# Altium schematic sheet STM_System_Board.schdoc
size 420 x 297 mm; EDA_Number: ARTIQ; Author: G.Kasprowicz; CompanyName: WUT ISE; DrawnBy: G.Kasprowicz, P. Kulik; DocumentNumber: 1; SheetNumber: 1; ModifiedBy: -; CheckedDate: -; Title2: Top; Designer: G.Kasprowicz, P. Kulik; ModifiedDate: -; ProjectName: Sensor Box
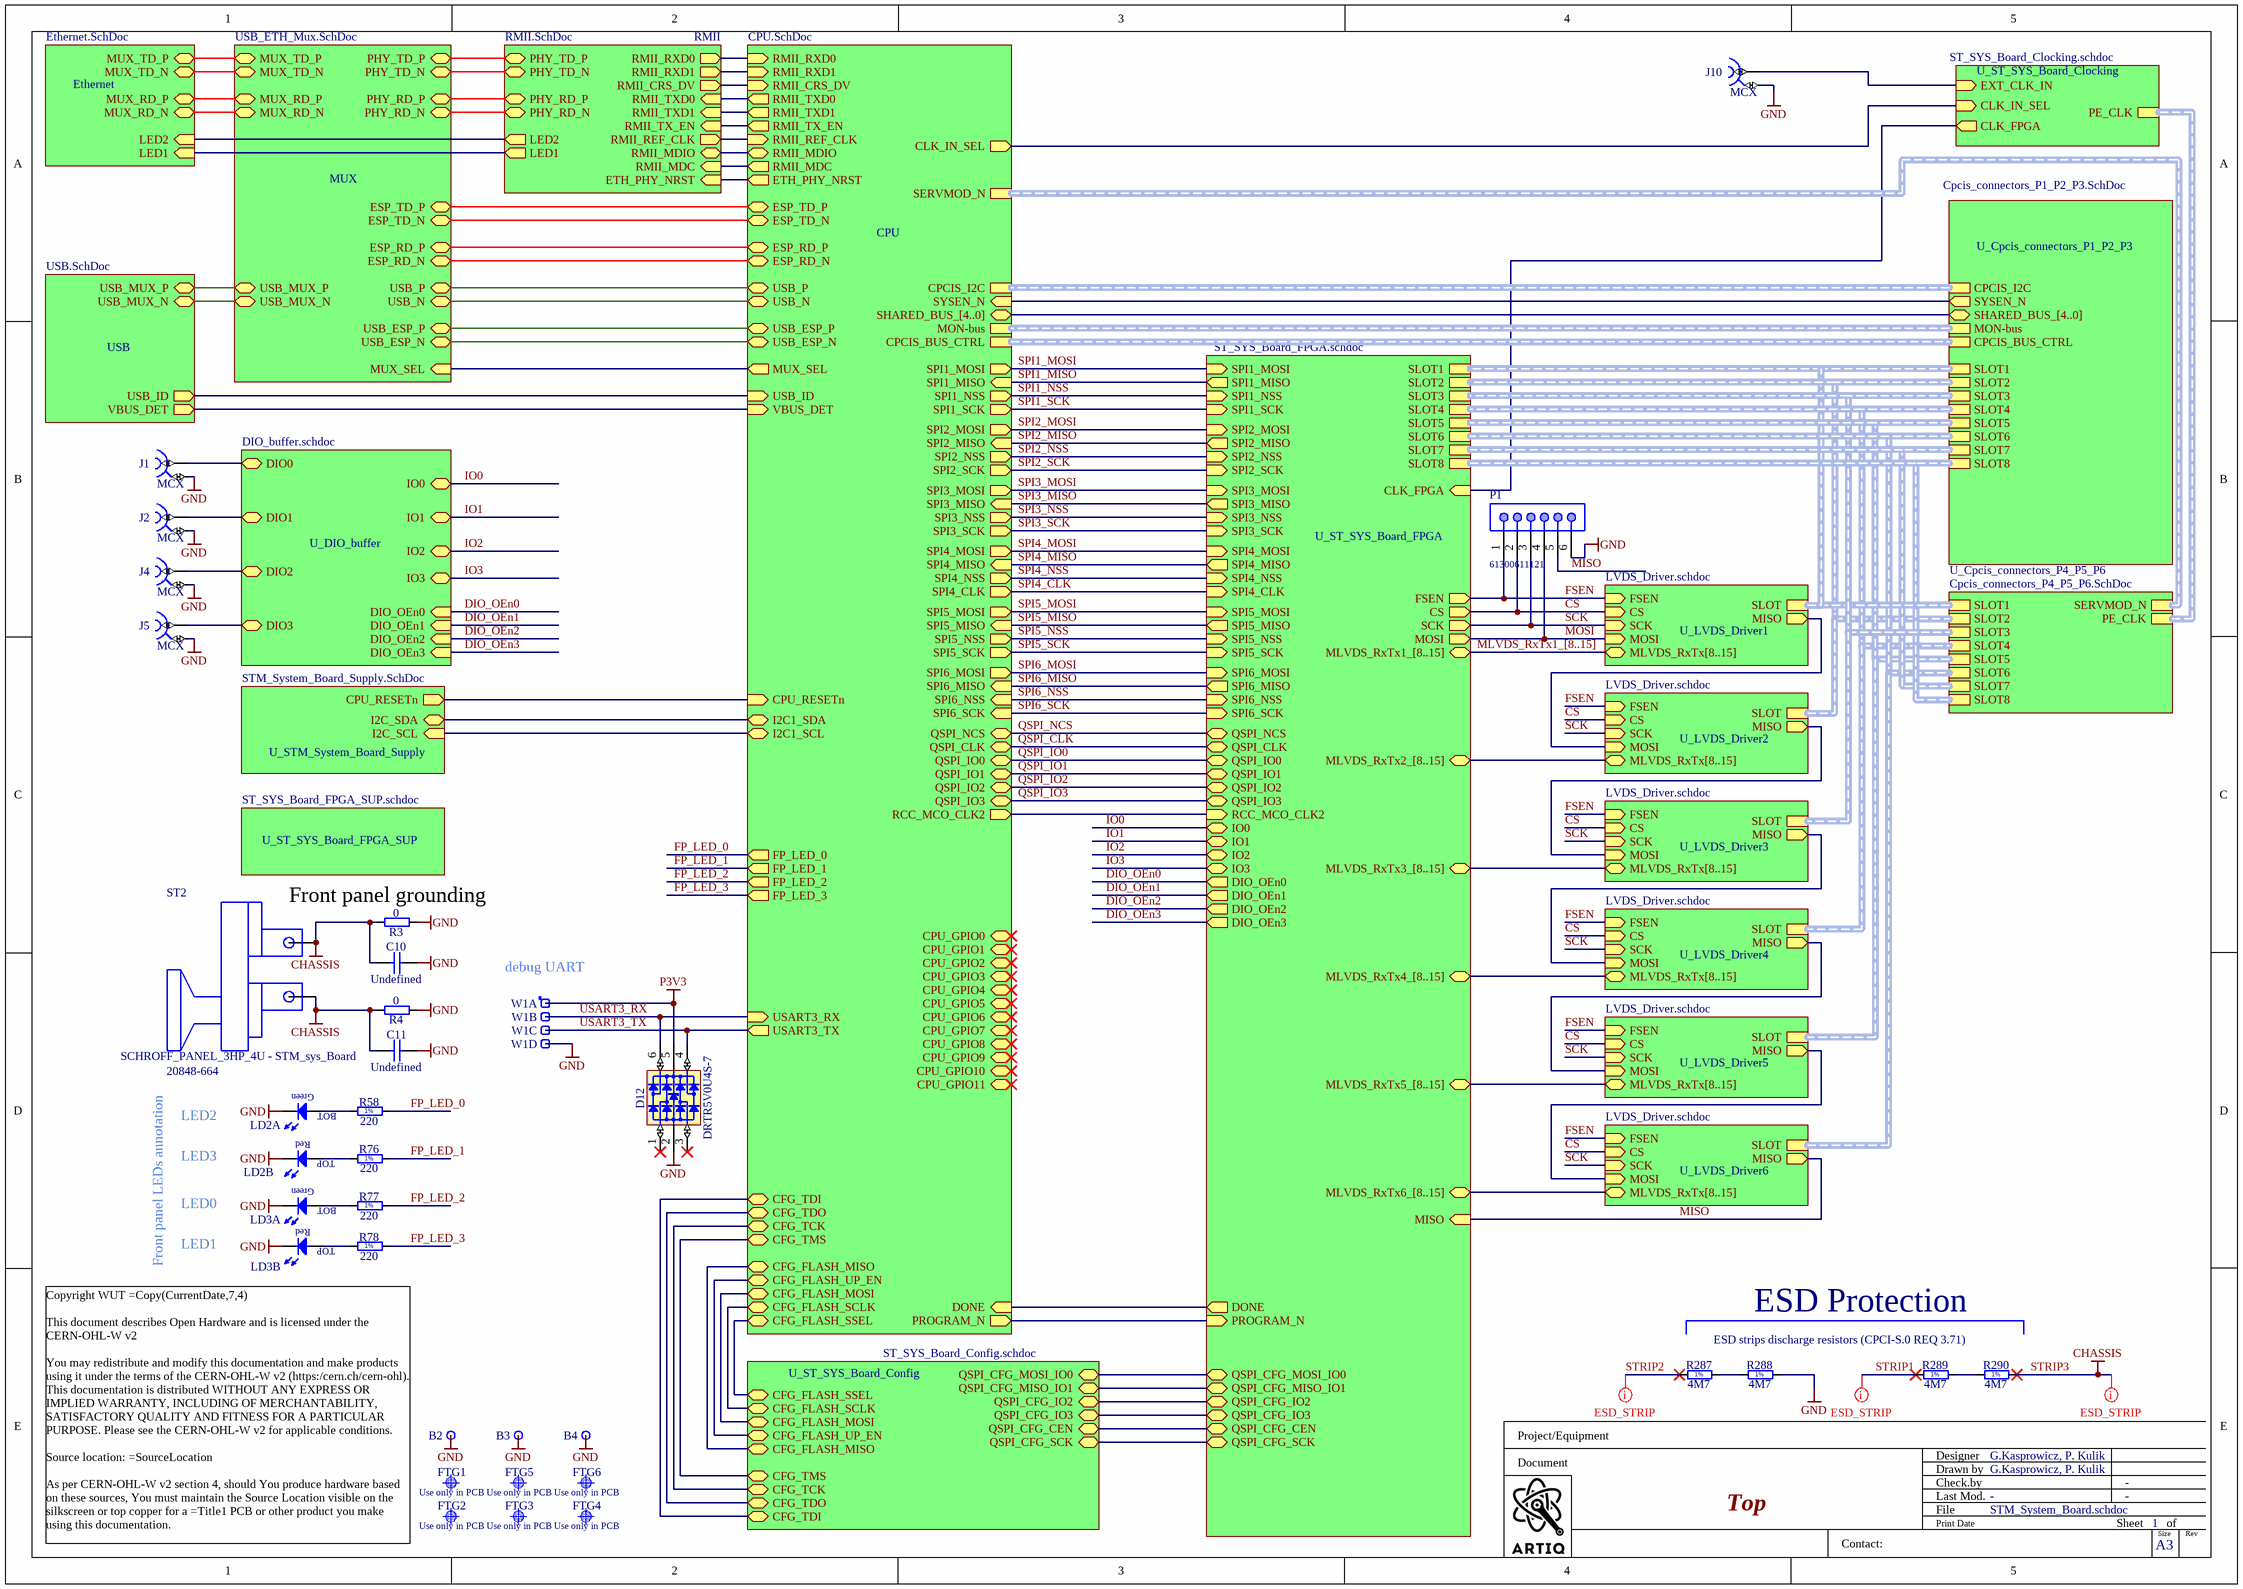
[diagram p0: STM_System_Board.schdoc]

## Parts
B2  Plated Hole  [c170h100]  (value not drawn)  (no BOM)
B3  Plated Hole  [c170h100]  (value not drawn)  (no BOM)
B4  Plated Hole  [c170h100]  (value not drawn)  (no BOM)
C10  Undefined  [CAPC2012X135N]
C11  Undefined  [CAPC2012X135N]
D12  DRTR5V0U4S-7  [SOT65P210X110-6N]
FTG1  Use only in PCB  [FIDUCIAL_TOP_C100-200]
FTG2  Use only in PCB  [FIDUCIAL_TOP_S100-200]
FTG3  Use only in PCB  [FIDUCIAL_TOP_S100-200]
FTG4  Use only in PCB  [FIDUCIAL_TOP_S100-200]
FTG5  Use only in PCB  [FIDUCIAL_TOP_C100-200]
FTG6  Use only in PCB  [FIDUCIAL_TOP_C100-200]
J1  MCX  [AMPHENOL_919-383J-51A]
J2  MCX  [AMPHENOL_919-383J-51A]
J4  MCX  [AMPHENOL_919-383J-51A]
J5  MCX  [AMPHENOL_919-383J-51A]
J10  MCX  [AMPHENOL_919-383J-51A]
LD2  Red/Green  [LED_DIALIGHT_571-0112F]  (value not drawn)  (parts A,B of 2)
LD3  Red/Green  [LED_DIALIGHT_571-0112F]  (value not drawn)  (parts A,B of 2)
P1  61300611121  [61300611121]
R3  0  [RESC1608X55N]
R4  0  [RESC1608X55N]
R58  220  [RESC1608X55N]
R76  220  [RESC1608X55N]
R77  220  [RESC1608X55N]
R78  220  [RESC1608X55N]
R287  4M7  [RESC2113X55N]
R288  4M7  [RESC2113X55N]
R289  4M7  [RESC2113X55N]
R290  4M7  [RESC2113X55N]
ST2  SCHROFF_PANEL_3HP_4U - STM_sys_Board  Manufacturer Part Number 2: 20848-664  [SCHROFF_PANEL_3HP_4U - STM_sys_Board]
W1  Header 4  [SAMTEC_HTSW-104-23-L-S]  (value not drawn)  (parts A,B,C,D of 4)

## Sub-sheets
CPU = CPU.SchDoc: SPI4_MOSI (out), SPI4_NSS (out), SPI4_CLK (out), SPI4_MISO (in), SPI1_SCK (out), SPI1_NSS (out), SPI1_MISO (in), SPI1_MOSI (out), SPI2_MOSI (out), SPI2_NSS (out), SPI2_SCK (out), SPI2_MISO (in), SPI3_SCK (out), SPI3_MOSI (out), SPI3_MISO (in), SPI3_NSS (out), SPI6_MOSI (out), SPI6_MISO (in), SPI6_NSS (in), SPI6_SCK (in), SPI5_NSS (out), SPI5_SCK (out), SPI5_MOSI (out), QSPI_IO0 (bidir), QSPI_NCS (bidir), QSPI_IO3 (bidir), QSPI_CLK (bidir), QSPI_IO1 (bidir), QSPI_IO2 (bidir), SERVMOD_N (harness SERVMOD_N), MON-bus (harness MON-bus), CPCIS_BUS_CTRL (harness CPCIS_BUS_CTRL), RMII_TXD0 (out), RMII_TX_EN (out), RMII_RXD0 (in), RMII_REF_CLK (in), RMII_CRS_DV (in), RMII_MDC (out), RMII_MDIO (bidir), RMII_TXD1 (out), RMII_RXD1 (in), ETH_PHY_NRST (out), SHARED_BUS_[4..0] (bidir), SYSEN_N (in), CPCIS_I2C (harness I2C), PROGRAM_N (out), CPU_GPIO3 (bidir), CPU_GPIO8 (bidir), CPU_GPIO4 (bidir), CPU_GPIO9 (bidir), CPU_GPIO5 (bidir), CPU_GPIO1 (bidir), CPU_GPIO7 (bidir), CPU_GPIO6 (bidir), CPU_GPIO2 (bidir), CPU_GPIO10 (bidir), CPU_GPIO11 (bidir), CPU_GPIO0 (bidir), DONE (in), RCC_MCO_CLK2 (out), SPI5_MISO (in), CPU_RESETn (in), I2C1_SDA (bidir), I2C1_SCL (bidir), CLK_IN_SEL (out), CFG_FLASH_SSEL (bidir), CFG_FLASH_SCLK (bidir), CFG_FLASH_MOSI (bidir), CFG_FLASH_UP_EN (bidir), CFG_FLASH_MISO (bidir), USART3_TX (out), USART3_RX (in), CFG_TMS (bidir), CFG_TCK (bidir), CFG_TDO (bidir), CFG_TDI (bidir), FP_LED_0 (out), FP_LED_1 (out), FP_LED_2 (out), FP_LED_3 (out), ESP_RD_P (bidir), ESP_TD_P (bidir), ESP_RD_N (bidir), ESP_TD_N (bidir), USB_N (bidir), USB_P (bidir), USB_ID (in), VBUS_DET (in), USB_ESP_N (bidir), USB_ESP_P (bidir), MUX_SEL (out)
Ethernet = Ethernet.SchDoc: MUX_RD_P (bidir), MUX_TD_P (bidir), MUX_RD_N (bidir), MUX_TD_N (bidir), LED2 (in), LED1 (in)
MUX = USB_ETH_Mux.SchDoc: MUX_RD_P (bidir), MUX_TD_P (bidir), MUX_RD_N (bidir), MUX_TD_N (bidir), PHY_RD_P (bidir), PHY_TD_P (bidir), PHY_RD_N (bidir), PHY_TD_N (bidir), ESP_RD_P (bidir), ESP_TD_P (bidir), ESP_RD_N (bidir), ESP_TD_N (bidir), USB_MUX_N (bidir), USB_MUX_P (bidir), USB_N (bidir), USB_P (bidir), USB_ESP_N (bidir), USB_ESP_P (bidir), MUX_SEL (in)
RMII = RMII.SchDoc: RMII_TXD0 (in), RMII_TX_EN (in), RMII_RXD0 (out), RMII_REF_CLK (out), RMII_CRS_DV (out), RMII_MDC (in), RMII_MDIO (bidir), ETH_PHY_NRST (in), RMII_TXD1 (in), RMII_RXD1 (out), PHY_RD_P (bidir), PHY_TD_P (bidir), PHY_RD_N (bidir), PHY_TD_N (bidir), LED2 (out), LED1 (out)
U_Cpcis_connectors_P1_P2_P3 = Cpcis_connectors_P1_P2_P3.SchDoc: CPCIS_BUS_CTRL (harness CPCIS_BUS_CTRL), MON-bus (harness MON-bus), SYSEN_N (out), SLOT7 (harness SLOT), SLOT2 (harness SLOT), SLOT3 (harness SLOT), SLOT1 (harness SLOT), SLOT4 (harness SLOT), SLOT5 (harness SLOT), SLOT6 (harness SLOT), SLOT8 (harness SLOT), SHARED_BUS_[4..0] (bidir), CPCIS_I2C (harness I2C)
U_Cpcis_connectors_P4_P5_P6 = Cpcis_connectors_P4_P5_P6.SchDoc: PE_CLK (harness PE_CLK), SLOT7 (harness SLOT), SLOT2 (harness SLOT), SLOT3 (harness SLOT), SLOT1 (harness SLOT), SLOT4 (harness SLOT), SLOT5 (harness SLOT), SLOT6 (harness SLOT), SLOT8 (harness SLOT), SERVMOD_N (harness SERVMOD_N)
U_DIO_buffer = DIO_buffer.schdoc: DIO_OEn0 (in), DIO_OEn1 (in), DIO_OEn2 (in), DIO_OEn3 (in), IO0 (bidir), IO1 (bidir), IO2 (bidir), IO3 (bidir), DIO0 (bidir), DIO1 (bidir), DIO2 (bidir), DIO3 (bidir)
U_LVDS_Driver1 = LVDS_Driver.schdoc: FSEN (in), CS (in), SCK (in), MOSI (in), MISO (out), SLOT (harness SLOT), MLVDS_RxTx[8..15] (bidir)
U_LVDS_Driver2 = LVDS_Driver.schdoc: FSEN (in), CS (in), SCK (in), MOSI (in), MISO (out), SLOT (harness SLOT), MLVDS_RxTx[8..15] (bidir)
U_LVDS_Driver3 = LVDS_Driver.schdoc: FSEN (in), CS (in), SCK (in), MOSI (in), MISO (out), SLOT (harness SLOT), MLVDS_RxTx[8..15] (bidir)
U_LVDS_Driver4 = LVDS_Driver.schdoc: FSEN (in), CS (in), SCK (in), MOSI (in), MISO (out), SLOT (harness SLOT), MLVDS_RxTx[8..15] (bidir)
U_LVDS_Driver5 = LVDS_Driver.schdoc: FSEN (in), CS (in), SCK (in), MOSI (in), MISO (out), SLOT (harness SLOT), MLVDS_RxTx[8..15] (bidir)
U_LVDS_Driver6 = LVDS_Driver.schdoc: FSEN (in), CS (in), SCK (in), MOSI (in), MISO (out), SLOT (harness SLOT), MLVDS_RxTx[8..15] (bidir)
U_ST_SYS_Board_Clocking = ST_SYS_Board_Clocking.schdoc: CLK_FPGA (out), PE_CLK (harness PE_CLK), CLK_IN_SEL (in), EXT_CLK_IN (in)
U_ST_SYS_Board_Config = ST_SYS_Board_Config.schdoc: QSPI_CFG_MOSI_IO0 (bidir), QSPI_CFG_MISO_IO1 (bidir), QSPI_CFG_IO2 (bidir), QSPI_CFG_IO3 (bidir), QSPI_CFG_CEN (bidir), QSPI_CFG_SCK (bidir), CFG_FLASH_SSEL (bidir), CFG_FLASH_SCLK (bidir), CFG_FLASH_MOSI (bidir), CFG_FLASH_UP_EN (bidir), CFG_FLASH_MISO (bidir), CFG_TMS (bidir), CFG_TCK (bidir), CFG_TDO (bidir), CFG_TDI (bidir)
U_ST_SYS_Board_FPGA = ST_SYS_Board_FPGA.schdoc: QSPI_NCS (bidir), QSPI_CLK (bidir), QSPI_IO0 (bidir), QSPI_IO1 (bidir), QSPI_IO2 (bidir), QSPI_IO3 (bidir), SPI1_MOSI (in), SPI1_MISO (out), SPI1_NSS (in), SPI1_SCK (in), SPI2_MOSI (in), SPI2_MISO (out), SPI2_NSS (in), SPI2_SCK (in), SPI3_MOSI (in), SPI3_MISO (out), SPI3_NSS (in), SPI3_SCK (in), SPI4_MOSI (in), SPI4_MISO (out), SPI4_NSS (in), SPI4_CLK (in), SPI5_MOSI (in), SPI5_NSS (in), SPI5_SCK (in), SPI6_MOSI (in), SPI6_MISO (out), SPI6_NSS (in), SPI6_SCK (in), SLOT7 (harness SLOT), SLOT2 (harness SLOT), SLOT3 (harness SLOT), SLOT1 (harness SLOT), SLOT4 (harness SLOT), SLOT5 (harness SLOT), SLOT6 (harness SLOT), SLOT8 (harness SLOT), FSEN (out), CS (out), SCK (out), MLVDS_RxTx1_[8..15] (bidir), MLVDS_RxTx2_[8..15] (bidir), MLVDS_RxTx4_[8..15] (bidir), MLVDS_RxTx3_[8..15] (bidir), MLVDS_RxTx6_[8..15] (bidir), MLVDS_RxTx5_[8..15] (bidir), MOSI (out), MISO (in), IO0 (bidir), IO1 (bidir), IO2 (bidir), IO3 (bidir), DIO_OEn0 (out), DIO_OEn1 (out), DIO_OEn2 (out), DIO_OEn3 (out), PROGRAM_N (in), DONE (out), CLK_FPGA (in), SPI5_MISO (out), RCC_MCO_CLK2 (in), QSPI_CFG_IO2 (bidir), QSPI_CFG_IO3 (bidir), QSPI_CFG_MISO_IO1 (bidir), QSPI_CFG_CEN (bidir), QSPI_CFG_MOSI_IO0 (bidir), QSPI_CFG_SCK (bidir)
U_ST_SYS_Board_FPGA_SUP = ST_SYS_Board_FPGA_SUP.schdoc: no entries
U_STM_System_Board_Supply = STM_System_Board_Supply.SchDoc: CPU_RESETn (out), I2C_SDA (bidir), I2C_SCL (in)
USB = USB.SchDoc: VBUS_DET (out), USB_MUX_N (bidir), USB_MUX_P (bidir), USB_ID (out)

## Nets
GND: B2.1 B3.1 B4.1 C10.2 C11.2 D12.2(GND) J1.2 J2.2 J4.2 J5.2 J10.2 LD2.1(C) LD2.3(C) LD3.1(C) LD3.3(C) P1.6 R3.1 R4.1 R288.2 W1.4
P3V3: D12.5(VBUS) W1.1
STRIP3: C10.1 C11.1 R3.2 R4.2 R290.2 ST2.0 ST2.1  [also labelled CHASSIS]
CS: P1.2 ; sheet U_ST_SYS_Board_FPGA/CS, sheet U_LVDS_Driver2/CS, sheet U_LVDS_Driver1/CS, sheet U_LVDS_Driver4/CS, sheet U_LVDS_Driver6/CS, sheet U_LVDS_Driver5/CS, sheet U_LVDS_Driver3/CS
DIO_OEn0: sheet U_ST_SYS_Board_FPGA/DIO_OEn0, sheet U_DIO_buffer/DIO_OEn0
DIO_OEn1: sheet U_ST_SYS_Board_FPGA/DIO_OEn1, sheet U_DIO_buffer/DIO_OEn1
DIO_OEn2: sheet U_ST_SYS_Board_FPGA/DIO_OEn2, sheet U_DIO_buffer/DIO_OEn2
DIO_OEn3: sheet U_ST_SYS_Board_FPGA/DIO_OEn3, sheet U_DIO_buffer/DIO_OEn3
FP_LED_0: R58.2 ; sheet CPU/FP_LED_0
FP_LED_1: R76.2 ; sheet CPU/FP_LED_1
FP_LED_2: R77.2 ; sheet CPU/FP_LED_2
FP_LED_3: R78.2 ; sheet CPU/FP_LED_3
FSEN: P1.1 ; sheet U_ST_SYS_Board_FPGA/FSEN, sheet U_LVDS_Driver2/FSEN, sheet U_LVDS_Driver1/FSEN, sheet U_LVDS_Driver4/FSEN, sheet U_LVDS_Driver6/FSEN, sheet U_LVDS_Driver5/FSEN, sheet U_LVDS_Driver3/FSEN
IO0: sheet U_ST_SYS_Board_FPGA/IO0, sheet U_DIO_buffer/IO0
IO1: sheet U_ST_SYS_Board_FPGA/IO1, sheet U_DIO_buffer/IO1
IO2: sheet U_ST_SYS_Board_FPGA/IO2, sheet U_DIO_buffer/IO2
IO3: sheet U_ST_SYS_Board_FPGA/IO3, sheet U_DIO_buffer/IO3
MISO: P1.5 ; sheet U_ST_SYS_Board_FPGA/MISO, sheet U_LVDS_Driver6/MISO
MOSI: P1.4 ; sheet U_ST_SYS_Board_FPGA/MOSI, sheet U_LVDS_Driver1/MOSI
QSPI_CLK: sheet CPU/QSPI_CLK, sheet U_ST_SYS_Board_FPGA/QSPI_CLK
QSPI_IO0: sheet CPU/QSPI_IO0, sheet U_ST_SYS_Board_FPGA/QSPI_IO0
QSPI_IO1: sheet CPU/QSPI_IO1, sheet U_ST_SYS_Board_FPGA/QSPI_IO1
QSPI_IO2: sheet CPU/QSPI_IO2, sheet U_ST_SYS_Board_FPGA/QSPI_IO2
QSPI_IO3: sheet CPU/QSPI_IO3, sheet U_ST_SYS_Board_FPGA/QSPI_IO3
QSPI_NCS: sheet CPU/QSPI_NCS, sheet U_ST_SYS_Board_FPGA/QSPI_NCS
SCK: P1.3 ; sheet U_ST_SYS_Board_FPGA/SCK, sheet U_LVDS_Driver2/SCK, sheet U_LVDS_Driver1/SCK, sheet U_LVDS_Driver4/SCK, sheet U_LVDS_Driver6/SCK, sheet U_LVDS_Driver5/SCK, sheet U_LVDS_Driver3/SCK
SPI1_MISO: sheet CPU/SPI1_MISO, sheet U_ST_SYS_Board_FPGA/SPI1_MISO
SPI1_MOSI: sheet CPU/SPI1_MOSI, sheet U_ST_SYS_Board_FPGA/SPI1_MOSI
SPI1_NSS: sheet CPU/SPI1_NSS, sheet U_ST_SYS_Board_FPGA/SPI1_NSS
SPI1_SCK: sheet CPU/SPI1_SCK, sheet U_ST_SYS_Board_FPGA/SPI1_SCK
SPI2_MISO: sheet CPU/SPI2_MISO, sheet U_ST_SYS_Board_FPGA/SPI2_MISO
SPI2_MOSI: sheet CPU/SPI2_MOSI, sheet U_ST_SYS_Board_FPGA/SPI2_MOSI
SPI2_NSS: sheet CPU/SPI2_NSS, sheet U_ST_SYS_Board_FPGA/SPI2_NSS
SPI2_SCK: sheet CPU/SPI2_SCK, sheet U_ST_SYS_Board_FPGA/SPI2_SCK
SPI3_MISO: sheet CPU/SPI3_MISO, sheet U_ST_SYS_Board_FPGA/SPI3_MISO
SPI3_MOSI: sheet CPU/SPI3_MOSI, sheet U_ST_SYS_Board_FPGA/SPI3_MOSI
SPI3_NSS: sheet CPU/SPI3_NSS, sheet U_ST_SYS_Board_FPGA/SPI3_NSS
SPI3_SCK: sheet CPU/SPI3_SCK, sheet U_ST_SYS_Board_FPGA/SPI3_SCK
SPI4_CLK: sheet CPU/SPI4_CLK, sheet U_ST_SYS_Board_FPGA/SPI4_CLK
SPI4_MISO: sheet CPU/SPI4_MISO, sheet U_ST_SYS_Board_FPGA/SPI4_MISO
SPI4_MOSI: sheet CPU/SPI4_MOSI, sheet U_ST_SYS_Board_FPGA/SPI4_MOSI
SPI4_NSS: sheet CPU/SPI4_NSS, sheet U_ST_SYS_Board_FPGA/SPI4_NSS
SPI5_MISO: sheet CPU/SPI5_MISO, sheet U_ST_SYS_Board_FPGA/SPI5_MISO
SPI5_MOSI: sheet CPU/SPI5_MOSI, sheet U_ST_SYS_Board_FPGA/SPI5_MOSI
SPI5_NSS: sheet CPU/SPI5_NSS, sheet U_ST_SYS_Board_FPGA/SPI5_NSS
SPI5_SCK: sheet CPU/SPI5_SCK, sheet U_ST_SYS_Board_FPGA/SPI5_SCK
SPI6_MISO: sheet CPU/SPI6_MISO, sheet U_ST_SYS_Board_FPGA/SPI6_MISO
SPI6_MOSI: sheet CPU/SPI6_MOSI, sheet U_ST_SYS_Board_FPGA/SPI6_MOSI
SPI6_NSS: sheet CPU/SPI6_NSS, sheet U_ST_SYS_Board_FPGA/SPI6_NSS
SPI6_SCK: sheet CPU/SPI6_SCK, sheet U_ST_SYS_Board_FPGA/SPI6_SCK
STRIP1: R289.1
STRIP2: R287.1
USART3_RX: D12.6(I/O4) W1.2 ; sheet CPU/USART3_RX
USART3_TX: D12.4(I/O3) W1.3 ; sheet CPU/USART3_TX
NetJ1_1: J1.1 ; sheet U_DIO_buffer/DIO0
NetJ2_1: J2.1 ; sheet U_DIO_buffer/DIO1
NetJ4_1: J4.1 ; sheet U_DIO_buffer/DIO2
NetJ5_1: J5.1 ; sheet U_DIO_buffer/DIO3
NetJ10_1: J10.1 ; sheet U_ST_SYS_Board_Clocking/EXT_CLK_IN
NetLD2_2: LD2.2(A) R58.1
NetLD2_4: LD2.4(A) R76.1
NetLD3_2: LD3.2(A) R77.1
NetLD3_4: LD3.4(A) R78.1
NetR287_2: R287.2 R288.1
NetR289_2: R289.2 R290.1
(unnamed): sheet USB/VBUS_DET, sheet CPU/VBUS_DET
(unnamed): sheet USB/USB_MUX_N, sheet MUX/USB_MUX_N
(unnamed): sheet USB/USB_MUX_P, sheet MUX/USB_MUX_P
(unnamed): sheet USB/USB_ID, sheet CPU/USB_ID
(unnamed): sheet CPU/RMII_TXD0, sheet RMII/RMII_TXD0
(unnamed): sheet CPU/RMII_TX_EN, sheet RMII/RMII_TX_EN
(unnamed): sheet CPU/RMII_RXD0, sheet RMII/RMII_RXD0
(unnamed): sheet CPU/RMII_REF_CLK, sheet RMII/RMII_REF_CLK
(unnamed): sheet CPU/RMII_CRS_DV, sheet RMII/RMII_CRS_DV
(unnamed): sheet CPU/RMII_MDC, sheet RMII/RMII_MDC
(unnamed): sheet CPU/RMII_MDIO, sheet RMII/RMII_MDIO
(unnamed): sheet CPU/RMII_TXD1, sheet RMII/RMII_TXD1
(unnamed): sheet CPU/RMII_RXD1, sheet RMII/RMII_RXD1
(unnamed): sheet CPU/ETH_PHY_NRST, sheet RMII/ETH_PHY_NRST
(unnamed): sheet CPU/SYSEN_N, sheet U_Cpcis_connectors_P1_P2_P3/SYSEN_N
(unnamed): sheet CPU/PROGRAM_N, sheet U_ST_SYS_Board_FPGA/PROGRAM_N
(unnamed): sheet CPU/DONE, sheet U_ST_SYS_Board_FPGA/DONE
(unnamed): sheet CPU/RCC_MCO_CLK2, sheet U_ST_SYS_Board_FPGA/RCC_MCO_CLK2
(unnamed): sheet CPU/CPU_RESETn, sheet U_STM_System_Board_Supply/CPU_RESETn
(unnamed): sheet CPU/I2C1_SDA, sheet U_STM_System_Board_Supply/I2C_SDA
(unnamed): sheet CPU/I2C1_SCL, sheet U_STM_System_Board_Supply/I2C_SCL
(unnamed): sheet CPU/CLK_IN_SEL, sheet U_ST_SYS_Board_Clocking/CLK_IN_SEL
(unnamed): sheet CPU/CFG_FLASH_SSEL, sheet U_ST_SYS_Board_Config/CFG_FLASH_SSEL
(unnamed): sheet CPU/CFG_FLASH_SCLK, sheet U_ST_SYS_Board_Config/CFG_FLASH_SCLK
(unnamed): sheet CPU/CFG_FLASH_MOSI, sheet U_ST_SYS_Board_Config/CFG_FLASH_MOSI
(unnamed): sheet CPU/CFG_FLASH_UP_EN, sheet U_ST_SYS_Board_Config/CFG_FLASH_UP_EN
(unnamed): sheet CPU/CFG_FLASH_MISO, sheet U_ST_SYS_Board_Config/CFG_FLASH_MISO
(unnamed): sheet CPU/CFG_TMS, sheet U_ST_SYS_Board_Config/CFG_TMS
(unnamed): sheet CPU/CFG_TCK, sheet U_ST_SYS_Board_Config/CFG_TCK
(unnamed): sheet CPU/CFG_TDO, sheet U_ST_SYS_Board_Config/CFG_TDO
(unnamed): sheet CPU/CFG_TDI, sheet U_ST_SYS_Board_Config/CFG_TDI
(unnamed): sheet CPU/ESP_RD_P, sheet MUX/ESP_RD_P
(unnamed): sheet CPU/ESP_TD_P, sheet MUX/ESP_TD_P
(unnamed): sheet CPU/ESP_RD_N, sheet MUX/ESP_RD_N
(unnamed): sheet CPU/ESP_TD_N, sheet MUX/ESP_TD_N
(unnamed): sheet CPU/USB_N, sheet MUX/USB_N
(unnamed): sheet CPU/USB_P, sheet MUX/USB_P
(unnamed): sheet CPU/USB_ESP_N, sheet MUX/USB_ESP_N
(unnamed): sheet CPU/USB_ESP_P, sheet MUX/USB_ESP_P
(unnamed): sheet CPU/MUX_SEL, sheet MUX/MUX_SEL
(unnamed): sheet U_ST_SYS_Board_FPGA/CLK_FPGA, sheet U_ST_SYS_Board_Clocking/CLK_FPGA
(unnamed): sheet U_ST_SYS_Board_FPGA/QSPI_CFG_IO2, sheet U_ST_SYS_Board_Config/QSPI_CFG_IO2
(unnamed): sheet U_ST_SYS_Board_FPGA/QSPI_CFG_IO3, sheet U_ST_SYS_Board_Config/QSPI_CFG_IO3
(unnamed): sheet U_ST_SYS_Board_FPGA/QSPI_CFG_MISO_IO1, sheet U_ST_SYS_Board_Config/QSPI_CFG_MISO_IO1
(unnamed): sheet U_ST_SYS_Board_FPGA/QSPI_CFG_CEN, sheet U_ST_SYS_Board_Config/QSPI_CFG_CEN
(unnamed): sheet U_ST_SYS_Board_FPGA/QSPI_CFG_MOSI_IO0, sheet U_ST_SYS_Board_Config/QSPI_CFG_MOSI_IO0
(unnamed): sheet U_ST_SYS_Board_FPGA/QSPI_CFG_SCK, sheet U_ST_SYS_Board_Config/QSPI_CFG_SCK
(unnamed): sheet U_LVDS_Driver2/MOSI, sheet U_LVDS_Driver1/MISO
(unnamed): sheet U_LVDS_Driver2/MISO, sheet U_LVDS_Driver3/MOSI
(unnamed): sheet U_LVDS_Driver4/MOSI, sheet U_LVDS_Driver3/MISO
(unnamed): sheet U_LVDS_Driver4/MISO, sheet U_LVDS_Driver5/MOSI
(unnamed): sheet U_LVDS_Driver6/MOSI, sheet U_LVDS_Driver5/MISO
(unnamed): sheet Ethernet/MUX_RD_P, sheet MUX/MUX_RD_P
(unnamed): sheet Ethernet/MUX_TD_P, sheet MUX/MUX_TD_P
(unnamed): sheet Ethernet/MUX_RD_N, sheet MUX/MUX_RD_N
(unnamed): sheet Ethernet/MUX_TD_N, sheet MUX/MUX_TD_N
(unnamed): sheet Ethernet/LED2, sheet RMII/LED2
(unnamed): sheet Ethernet/LED1, sheet RMII/LED1
(unnamed): sheet RMII/PHY_RD_P, sheet MUX/PHY_RD_P
(unnamed): sheet RMII/PHY_TD_P, sheet MUX/PHY_TD_P
(unnamed): sheet RMII/PHY_RD_N, sheet MUX/PHY_RD_N
(unnamed): sheet RMII/PHY_TD_N, sheet MUX/PHY_TD_N

Not connected (* = marked no-connect by the designer): D12 1(I/O1)* 3(I/O2)*

## Buses and harness runs
bus MLVDS_RxTx1_[8..15] = sheet U_LVDS_Driver1/MLVDS_RxTx[8..15] = sheet U_ST_SYS_Board_FPGA/MLVDS_RxTx1_[8..15]
bus sheet CPU/SHARED_BUS_[4..0] = sheet U_Cpcis_connectors_P1_P2_P3/SHARED_BUS_[4..0]
bus sheet U_LVDS_Driver2/MLVDS_RxTx[8..15] = sheet U_ST_SYS_Board_FPGA/MLVDS_RxTx2_[8..15]
bus sheet U_LVDS_Driver3/MLVDS_RxTx[8..15] = sheet U_ST_SYS_Board_FPGA/MLVDS_RxTx3_[8..15]
bus sheet U_LVDS_Driver4/MLVDS_RxTx[8..15] = sheet U_ST_SYS_Board_FPGA/MLVDS_RxTx4_[8..15]
bus sheet U_LVDS_Driver5/MLVDS_RxTx[8..15] = sheet U_ST_SYS_Board_FPGA/MLVDS_RxTx5_[8..15]
bus sheet U_LVDS_Driver6/MLVDS_RxTx[8..15] = sheet U_ST_SYS_Board_FPGA/MLVDS_RxTx6_[8..15]
harness sheet CPU/CPCIS_BUS_CTRL = sheet U_Cpcis_connectors_P1_P2_P3/CPCIS_BUS_CTRL
harness sheet CPU/CPCIS_I2C = sheet U_Cpcis_connectors_P1_P2_P3/CPCIS_I2C
harness sheet CPU/MON-bus = sheet U_Cpcis_connectors_P1_P2_P3/MON-bus
harness sheet CPU/SERVMOD_N = sheet U_Cpcis_connectors_P4_P5_P6/SERVMOD_N
harness sheet U_Cpcis_connectors_P1_P2_P3/SLOT1 = sheet U_Cpcis_connectors_P4_P5_P6/SLOT1 = sheet U_LVDS_Driver1/SLOT = sheet U_ST_SYS_Board_FPGA/SLOT1
harness sheet U_Cpcis_connectors_P1_P2_P3/SLOT2 = sheet U_Cpcis_connectors_P4_P5_P6/SLOT2 = sheet U_LVDS_Driver2/SLOT = sheet U_ST_SYS_Board_FPGA/SLOT2
harness sheet U_Cpcis_connectors_P1_P2_P3/SLOT3 = sheet U_Cpcis_connectors_P4_P5_P6/SLOT3 = sheet U_LVDS_Driver3/SLOT = sheet U_ST_SYS_Board_FPGA/SLOT3
harness sheet U_Cpcis_connectors_P1_P2_P3/SLOT4 = sheet U_Cpcis_connectors_P4_P5_P6/SLOT4 = sheet U_LVDS_Driver4/SLOT = sheet U_ST_SYS_Board_FPGA/SLOT4
harness sheet U_Cpcis_connectors_P1_P2_P3/SLOT5 = sheet U_Cpcis_connectors_P4_P5_P6/SLOT5 = sheet U_LVDS_Driver5/SLOT = sheet U_ST_SYS_Board_FPGA/SLOT5
harness sheet U_Cpcis_connectors_P1_P2_P3/SLOT6 = sheet U_Cpcis_connectors_P4_P5_P6/SLOT6 = sheet U_LVDS_Driver6/SLOT = sheet U_ST_SYS_Board_FPGA/SLOT6
harness sheet U_Cpcis_connectors_P1_P2_P3/SLOT7 = sheet U_Cpcis_connectors_P4_P5_P6/SLOT7 = sheet U_ST_SYS_Board_FPGA/SLOT7
harness sheet U_Cpcis_connectors_P1_P2_P3/SLOT8 = sheet U_Cpcis_connectors_P4_P5_P6/SLOT8 = sheet U_ST_SYS_Board_FPGA/SLOT8
harness sheet U_Cpcis_connectors_P4_P5_P6/PE_CLK = sheet U_ST_SYS_Board_Clocking/PE_CLK

## Layout directives
net class ESD_STRIP: STRIP1, STRIP2, STRIP3

## Notes on the sheet
- (near R3) Front panel grounding
- (near W1) debug UART
- LED2
- LED0
- LED3
- Front panel LEDs annotation
- LED1
- ESD strips discharge resistors (CPCI-S.0 REQ 3.71)
- ESD Protection
- Project/Equipment
- Document
- Designer
- Drawn by
- Check.by
- Copyright WUT =Copy(CurrentDate,7,4)
  This document describes Open Hardware and is licensed under the CERN-OHL-W v2
  You may redistribute and modify this documentation and make products using it under the terms of the CERN-OHL-W v2 (https:/cern.ch/cern-ohl). This documentation is distributed WITHOUT ANY EXPRESS OR IMPLIED WARRANTY, INCLUDING OF MERCHANTABILITY, SATISFACTORY QUALITY AND FITNESS FOR A PARTICULAR PURPOSE. Please see the CERN-OHL-W v2 for applicable conditions.
  Source location: =SourceLocation
  As per CERN-OHL-W v2 section 4, should You produce hardware based on these sources, You must maintain the Source Location visible on the silkscreen or top copper for a =Title1 PCB or other product you make using this documentation.
- Contact:
- File
- Last Mod.
- Print Date
- Sheet
- Size
- A3
- of
- Rev
- (in symbol LED_DIALIGHT_571-0112F, part A) Green; BOT
- (in symbol LED_DIALIGHT_571-0112F, part B) Red; TOP
- (in symbol R0603_220R_1%_0.1W_100PPM) 1%
- (in symbol R0805_4M7_1%_0.125W_100PPM_VISHAY_CRCW e3) 1%

## Library data of the parts
B2-B4 = PLATED_HOLE1.0_PAD1.7: Single Terminal Socket; Part Description: Plated Through Hole: Hole Dia.=1.0mm Pad Dia.=1.7mm,  IPC-7251 Level A; Mounted: No; Part Number: PLATED_HOLE1.0_PAD1.7; Component Type: Standard (No BOM); Pin Count: 1; Family: Plated Hole; Socket: No; SMD: No; Sense: No; Status: None; ComponentHeight: 0mm; HelpURL: Undefined; Author: CERN DEM JLC; CreateDate: 11.05.2017; LatestRevisionDate: 11.05.2017; PackageDescription: Plated Through Hole: Hole Dia.=1.0mm Pad Dia.=1.7mm,  IPC-7251 Level A
C10 C11 = CC0805_NO-VALUE: Non-polarised capacitor; Part Description: Reserved Footprint For 0805(2012) Chip Ceramic Capacitor; Mounted: No; Part Number: CC0805_NO-VALUE; Component Kind: Standard; Component Type: Standard; Pin Count: 2; Value: Undefined; Status: None; Manufacturer: Undefined; Manufacturer Part Number: CC0805_NO-VALUE; Case: 0805; Socket: No; SMD: Yes; Sense: No; Manufacturer1 ComponentHeight: 1.35mm; HelpURL: Undefined; Author: CERN DEM JLC; CreateDate: 10.12.2008; LatestRevisionDate: 11.09.2013
D12 = D_TVS_DRTR5V0U4S-7: Integrated Quad Ultra-Low Capacitance ESD Protection; Part Description: Integrated Quad Ultra-Low Capacitance ESD (±8kV) Protection; Manufacturer: DIODES; PressFit: No; Bonding: No; Status Comment: Active; Part Number: DRTR5V0U4S-7; Component Kind: Standard; Component Type: Standard; Device: DRTR5V0U4S-7; PackageDescription: SOT363, SC70-6, 0.65mm Pitch; 6 Pin, 1.25mm W X 2.00mm L X 1.10mm H body, IPC Medium Density; Status: Active; Manufacturer Part Number: DRTR5V0U4S-7; Pin Count: 6; Case: SOT363; Mounted: Yes; Socket: No; SMD: Yes; Sense: No; ComponentHeight: 1.1mm; HelpURL: \\cern.ch\dfs\Applications\Altium\Datasheets\PRTR5V0U4Y.pdf; Author: GK; CreateDate: 24.01.2017; LatestRevisionDate: 14.09.2020
FTG1 FTG5 FTG6 = FIDUCIAL_TARGET_C100-200: Fiducial Target; Part Description: Round Fiducial Target, Top Layer, 1.0mm, Top Solder 2.0mm, Keepout =2.0mm; Mounted: No; Part Number: FIDUCIAL_TARGET_C100-200; Component Kind: Standard (No BOM); Component Type: Standard (No BOM); Pin Count: 1; Family: Fiducial; Socket: No; SMD: Yes; Sense: No; Status: None; ComponentHeight: 0mm; HelpURL: Undefined; Author: CERN DEM JLC; CreateDate: 09.02.2010; LatestRevisionDate: 04.04.2012; PackageDescription: Round Fiducial Target, Top Layer, 1.0mm, Top Solder 2.0mm, Keepout =2.0mm
FTG2-FTG4 = FIDUCIAL_TARGET_S100-200: Fiducial Target; Part Description: Square Fiducial Target, Top Layer, 1.0mm, Top Solder 2.0mm, Keepout =2.0mm; Mounted: No; Part Number: FIDUCIAL_TARGET_S100-200; Component Kind: Standard (No BOM); Component Type: Standard (No BOM); Pin Count: 1; Family: Fiducial; Socket: No; SMD: Yes; Sense: No; Status: None; ComponentHeight: 0mm; HelpURL: Undefined; Author: CERN DEM JLC; CreateDate: 09.02.2010; LatestRevisionDate: 04.04.2012; PackageDescription: Square Fiducial Target, Top Layer, 1.0mm, Top Solder 2.0mm, Keepout =2.0mm
J1 J2 J4 J5 J10 = AMPHENOL_919-383J-51A: Part Description: 50 Ohm, RF Connector, MCX Right Angle PCB Receptacle Jack; PressFit: No; Part Number: AMPHENOL_919-383J-51A; Component Kind: Standard; Component Type: Standard; Pin Count: 5; Family: MCX; Mounted: Yes; Socket: No; SMD: No; Sense: No; Status: None; Manufacturer: AMPHENOL; Manufacturer Part Number: 919-383J-51A; ComponentHeight: 6mm; HelpURL: \\cern.ch\dfs\Applications\Altium\Datasheets\AMPHENOL_919-383J-51A.pdf; Author: CERN DEM BC; CreateDate: 31.01.2019; LatestRevisionDate: 31.01.2019
LD2 LD3 = LED_DIALIGHT_571-0112F: 2x LED  Botom Green, Top Red; Part Description: Dual 2mm  LEDs, Red Top,Green Bot, CBI® Circuit Board Indicator (Without positioning pins); PressFit: No; Bonding: No; Part Number: LED_DIALIGHT_571-0112F; Component Kind: Standard; Component Type: Standard; Color: Red/Green; PackageDescription: 2x 2mm LED (Top: Red, Bot: Green) PCB Edge Mounting (Without positioning pins) DIALIGHT 571 Serie; Manufacturer: DIALIGHT; Manufacturer Part Number: 571-0112F; Pin Count: 4; Mounted: Yes; Socket: No; SMD: No; Sense: No; ComponentHeight: 8.6mm; HelpURL: \\cern.ch\dfs\Applications\Altium\Datasheets\LED_DIALIGHT_571-0112F.pdf; Author: CERN DEM JLC; CreateDate: 09/11/2009; LatestRevisionDate: 17/03/2010
P1 = 61300611121: WR-PHD Pin Header, THT, pitch 2.54mm, Single Row, Vertical, 6p; Manufacturer: Wurth Elektronik; Pin Number: 6; Rated Current: 3A; Working Voltage: 250VAC; Withstanding Voltage: 500VAC; Contact Resistance: 20mOhm; ComponentLink1Description: Manufacturer; ComponentLink1URL: http://www.we-online.de; ComponentLink2Description: Datasheet; ComponentLink2URL: https://www.we-online.com/catalog/datasheet/61300611121.pdf; Manufacturer Part Number: 61300611121; Published Date: May 2020; Pitch: 2.54mm; Operating Temperature: -40 to +105degC; Mounting Technology: THT; Packaging: Bag; Gender: Pin Header; Row Number: Single; Orientation: Vertical
R3 R4 = R0603_0R_JUMPER: Resistor; Part Description: 1A (0.05R Max DC Resistance) Zero Ohm Jumper; Manufacturer: GENERIC; Manufacturer1 Part Number: NRC06Z0; PressFit: No; Part Number: R0603_0R_JUMPER; Component Kind: Standard; Component Type: Standard; Pin Count: 2; Value: 0; Status: Preferred; Manufacturer Part Number: R0603_0R_JUMPER; Case: 0603; Mounted: Yes; Sense: No; Socket: No; SMD: Yes; Manufacturer1 Example: NIC COMPONENT; Manufacturer1 ComponentHeight: 0.55mm; HelpURL: \\cern.ch\dfs\Applications\Altium\Datasheets\R0603_NIC_NRC.pdf; Author: CERN DEM JLC; CreateDate: 03.12.2007; LatestRevisionDate: 13.03.2008
R58 R76-R78 = R0603_220R_1%_0.1W_100PPM: Resistor - 1%; Part Description: General Purpose Thick Film Chip Resistor; Manufacturer: GENERIC; Manufacturer1 Part Number: NRC06F2200TRF; Power: 0.1W; TC: ±100ppm/°C; Part Number: R0603_220R_1%_0.1W_100PPM; Component Kind: Standard; Component Type: Standard; Pin Count: 2; Value: 220; Status: Preferred; Tolerance: ±1%; Manufacturer Part Number: R0603_220R_1%_0.1W_100PPM; Case: 0603; Mounted: Yes; Sense: No; Socket: No; SMD: Yes; Manufacturer1 Example: NIC COMPONENT; Manufacturer1 ComponentHeight: 0.55mm; HelpURL: \\cern.ch\dfs\Applications\Altium\Datasheets\R0603_NIC_NRC.pdf; Author: CERN DEM JLC; CreateDate: 03.12.2007; LatestRevisionDate: 13.03.2008
R287-R290 = R0805_4M7_1%_0.125W_100PPM_VISHAY_CRCW e3: Resistor - 1%; Part Description: 150V, Standard Thick Film Chip Resistor; Manufacturer: VISHAY; Manufacturer Part Number: CRCW08054M70FKEA; Power: 0.125W; TC: ±100ppm/°C; PressFit: No; Part Number: R0805_4M7_1%_0.125W_100PPM_VISHAY_CRCW e3; Component Kind: Standard; Component Type: Standard; Pin Count: 2; Value: 4M7; Status: None; Tolerance: ±1%; Case: 0805; Mounted: Yes; Sense: No; Socket: No; SMD: Yes; ComponentHeight: 0.5mm; HelpURL: \\cern.ch\dfs\Applications\Altium\Datasheets\R0805_VISHAY_CRCW e3.pdf; Author: CERN DEM BR; CreateDate: 27/05/2019; LatestRevisionDate: 27/05/2019
ST2 = SCHROFF_PANEL_3HP_4U - STM_sys_Board: Schroff 3HP 4U EUROCARD Panel; Manufacturer Part Number: 20818-017; Manufacturer: Schroff
W1 = SAMTEC_HTSW-104-23-L-S: 4 Mini Wire-Wrap Contact Strip Header; Part Description: 4 Contacts, Pitch 2.54mm, Single Row  Through Mount Straight Header (Post Lead 5.84mm, Tail Lead 2.92mm, Insulator 2.54mm); Manufacturer: SAMTEC; PressFit: No; Status Comment: High Temperature; Part Number: SAMTEC_HTSW-104-23-L-S; Component Kind: Standard; Component Type: Standard; Pin Count: 4; Family: Header 4; Mounted: Yes; Socket: No; Sense: No; SMD: No; Status: Preferred; Manufacturer Part Number: HTSW-104-23-L-S; ComponentHeight: 8.38mm; HelpURL: \\cern.ch\dfs\Applications\Altium\Datasheets\SAMTEC_HTSW-104-23-L-S.pdf; Author: CERN DEM JLC; CreateDate: 22/02/2018; LatestRevisionDate: 22/02/2018